# EAGLE schematic protoshield-wiring (EAGLE 7.5.0)
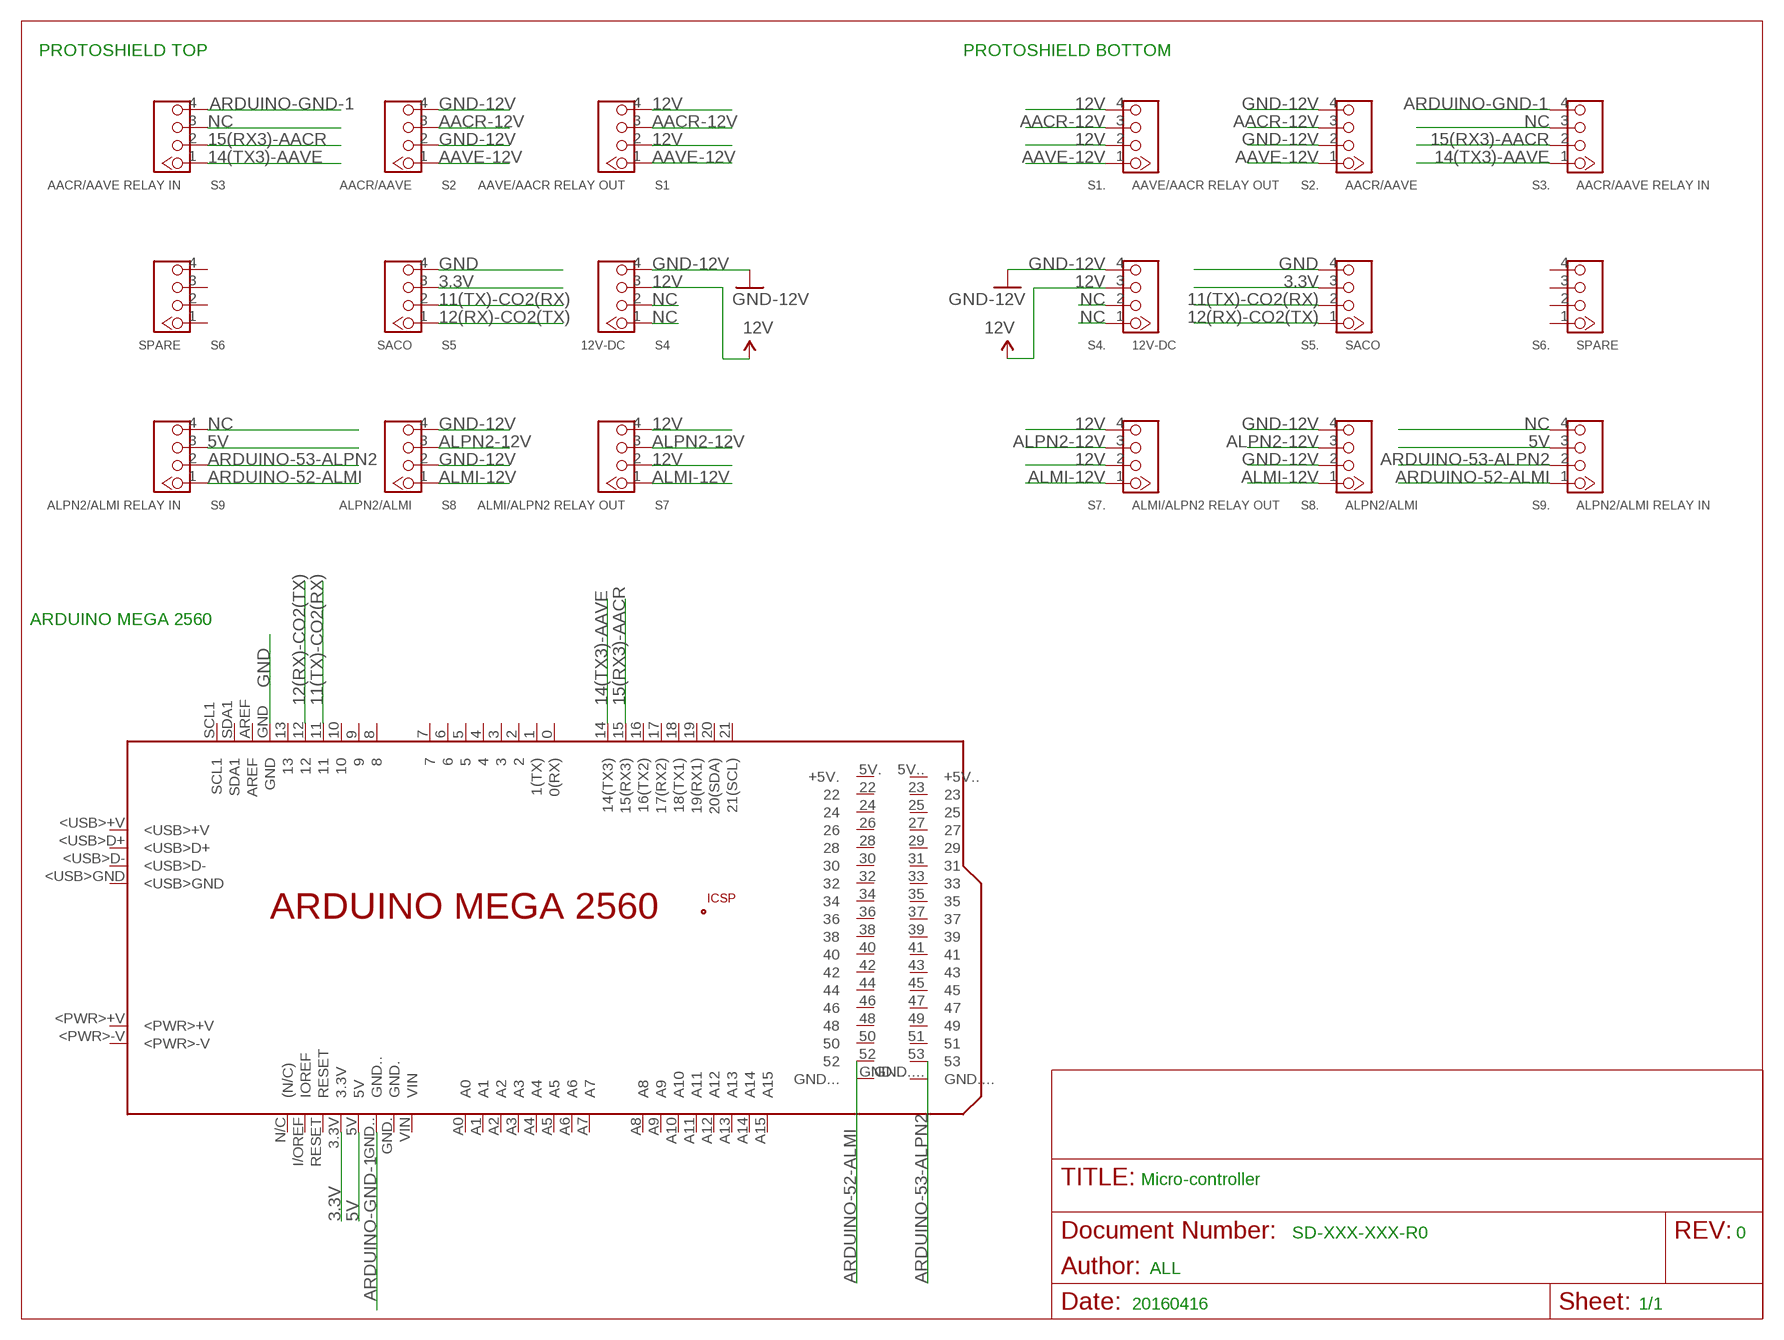
[diagram p0: schematic, sheet 1]

## Parts
PCB1  ARDUINO_MEGA2560  [ARDUINO_MEGA2560]
S1  AAVE/AACR RELAY OUT  GROVE-CONNECTOR-DIP(4P-2.0)  [HW4-2.0]
S1.  AAVE/AACR RELAY OUT  GROVE-CONNECTOR-DIP(4P-2.0)  [HW4-2.0]
S2  AACR/AAVE  GROVE-CONNECTOR-DIP(4P-2.0)  [HW4-2.0]
S2.  AACR/AAVE  GROVE-CONNECTOR-DIP(4P-2.0)  [HW4-2.0]
S3  AACR/AAVE RELAY IN  GROVE-CONNECTOR-DIP(4P-2.0)  [HW4-2.0]
S3.  AACR/AAVE RELAY IN  GROVE-CONNECTOR-DIP(4P-2.0)  [HW4-2.0]
S4  12V-DC  GROVE-CONNECTOR-DIP(4P-2.0)  [HW4-2.0]
S4.  12V-DC  GROVE-CONNECTOR-DIP(4P-2.0)  [HW4-2.0]
S5  SACO  GROVE-CONNECTOR-DIP(4P-2.0)  [HW4-2.0]
S5.  SACO  GROVE-CONNECTOR-DIP(4P-2.0)  [HW4-2.0]
S6  SPARE  GROVE-CONNECTOR-DIP(4P-2.0)  [HW4-2.0]
S6.  SPARE  GROVE-CONNECTOR-DIP(4P-2.0)  [HW4-2.0]
S7  ALMI/ALPN2 RELAY OUT  GROVE-CONNECTOR-DIP(4P-2.0)  [HW4-2.0]
S7.  ALMI/ALPN2 RELAY OUT  GROVE-CONNECTOR-DIP(4P-2.0)  [HW4-2.0]
S8  ALPN2/ALMI  GROVE-CONNECTOR-DIP(4P-2.0)  [HW4-2.0]
S8.  ALPN2/ALMI  GROVE-CONNECTOR-DIP(4P-2.0)  [HW4-2.0]
S9  ALPN2/ALMI RELAY IN  GROVE-CONNECTOR-DIP(4P-2.0)  [HW4-2.0]
S9.  ALPN2/ALMI RELAY IN  GROVE-CONNECTOR-DIP(4P-2.0)  [HW4-2.0]

## Nets
3.3V: PCB1.3.3V S5.3 S5..3
5V: PCB1.5V S9.3 S9..3
11(TX)-CO2(RX): PCB1.11 S5.2 S5..2
12(RX)-CO2(TX): PCB1.12 S5.1 S5..1
12V: S1.2 S1.4 S1..2 S1..4 S4.3 S4..3 S7.2 S7.4 S7..2 S7..4
14(TX3)-AAVE: PCB1.14(14(TX3)) S3.1 S3..1
15(RX3)-AACR: PCB1.15(15(RX3)) S3.2 S3..2
AACR-12V: S1.3 S1..3 S2.3 S2..3
AAVE-12V: S1.1 S1..1 S2.1 S2..1
ALMI-12V: S7.1 S7..1 S8.1 S8..1
ALPN2-12V: S7.3 S7..3 S8.3 S8..3
ARDUINO-52-ALMI: S9.1 S9..1
ARDUINO-53-ALPN2: S9.2 S9..2
ARDUINO-GND-1: PCB1.GND.. S3.4 S3..4
GND: PCB1.GND S5.4 S5..4
GND-12V: S2.2 S2.4 S2..2 S2..4 S4.4 S4..4 S8.2 S8.4 S8..2 S8..4
NC: S3.3 S3..3 S4.1 S4.2 S4..1 S4..2 S9.4 S9..4
Unconnected: PCB1.0(0(RX)) PCB1.1(1(TX)) PCB1.2 PCB1.3 PCB1.4 PCB1.5 PCB1.5V.(+5V.) PCB1.5V..(+5V..) PCB1.6 PCB1.7 PCB1.8 PCB1.9 PCB1.10 PCB1.13 PCB1.16(16(TX2)) PCB1.17(17(RX2)) PCB1.18(18(TX1)) PCB1.19(19(RX1)) PCB1.20(20(SDA)) PCB1.21(21(SCL)) PCB1.22 PCB1.23 PCB1.24 PCB1.25 PCB1.26 PCB1.27 PCB1.28 PCB1.29 PCB1.30 PCB1.31 PCB1.32 PCB1.33 PCB1.34 PCB1.35 PCB1.36 PCB1.37 PCB1.38 PCB1.39 PCB1.40 PCB1.41 PCB1.42 PCB1.43 PCB1.44 PCB1.45 PCB1.46 PCB1.47 PCB1.48 PCB1.49 PCB1.50 PCB1.51 PCB1.52 PCB1.53 PCB1.+5V_ PCB1.<PWR>+V PCB1.<PWR>-V PCB1.<USB>+V PCB1.<USB>D+ PCB1.<USB>D- PCB1.<USB>GND PCB1.A0 PCB1.A1 PCB1.A2 PCB1.A3 PCB1.A4 PCB1.A5 PCB1.A6 PCB1.A7 PCB1.A8 PCB1.A9 PCB1.A10 PCB1.A11 PCB1.A12 PCB1.A13 PCB1.A14 PCB1.A15 PCB1.AREF PCB1.GND. PCB1.GND... PCB1.GND.... PCB1.GND__ PCB1.I/OREF(IOREF) PCB1.MISO PCB1.MOSI PCB1.N/C((N/C)) PCB1.RESET PCB1.RESET. PCB1.SCK PCB1.SCL1 PCB1.SDA1 PCB1.VIN S6.1 S6.2 S6.3 S6.4 S6..1 S6..2 S6..3 S6..4

## Notes on the sheet
- PROTOSHIELD TOP | PROTOSHIELD BOTTOM
- ARDUINO MEGA 2560
- Micro-controller
- SD-XXX-XXX-R0 | 0
- ALL
- 20160416 | 1/1

## Library data of the parts
PCB1 = E14_Arduino_revB:ARDUINO_MEGA2560: Device for representing an Arduino Mega 2560 board with a footprint in an EAGLE design. Created by Dave Young for Element14. More EAGLE documentation at: http://www.element14.com/community/community/knode/cadsoft_eagle
S1 S1. S2 S2. S3 S3. S4 S4. S5 S5. S6 S6. S7 S7. S8 S8. S9 S9. = Seeed-Connector -2016:GROVE-CONNECTOR-DIP(4P-2.0): 320110033; VALUE: 4P-2.0